# Altium schematic sheet I2C_Shield.SchDoc
size A2; SheetNumber: 1; SheetTotal: 1
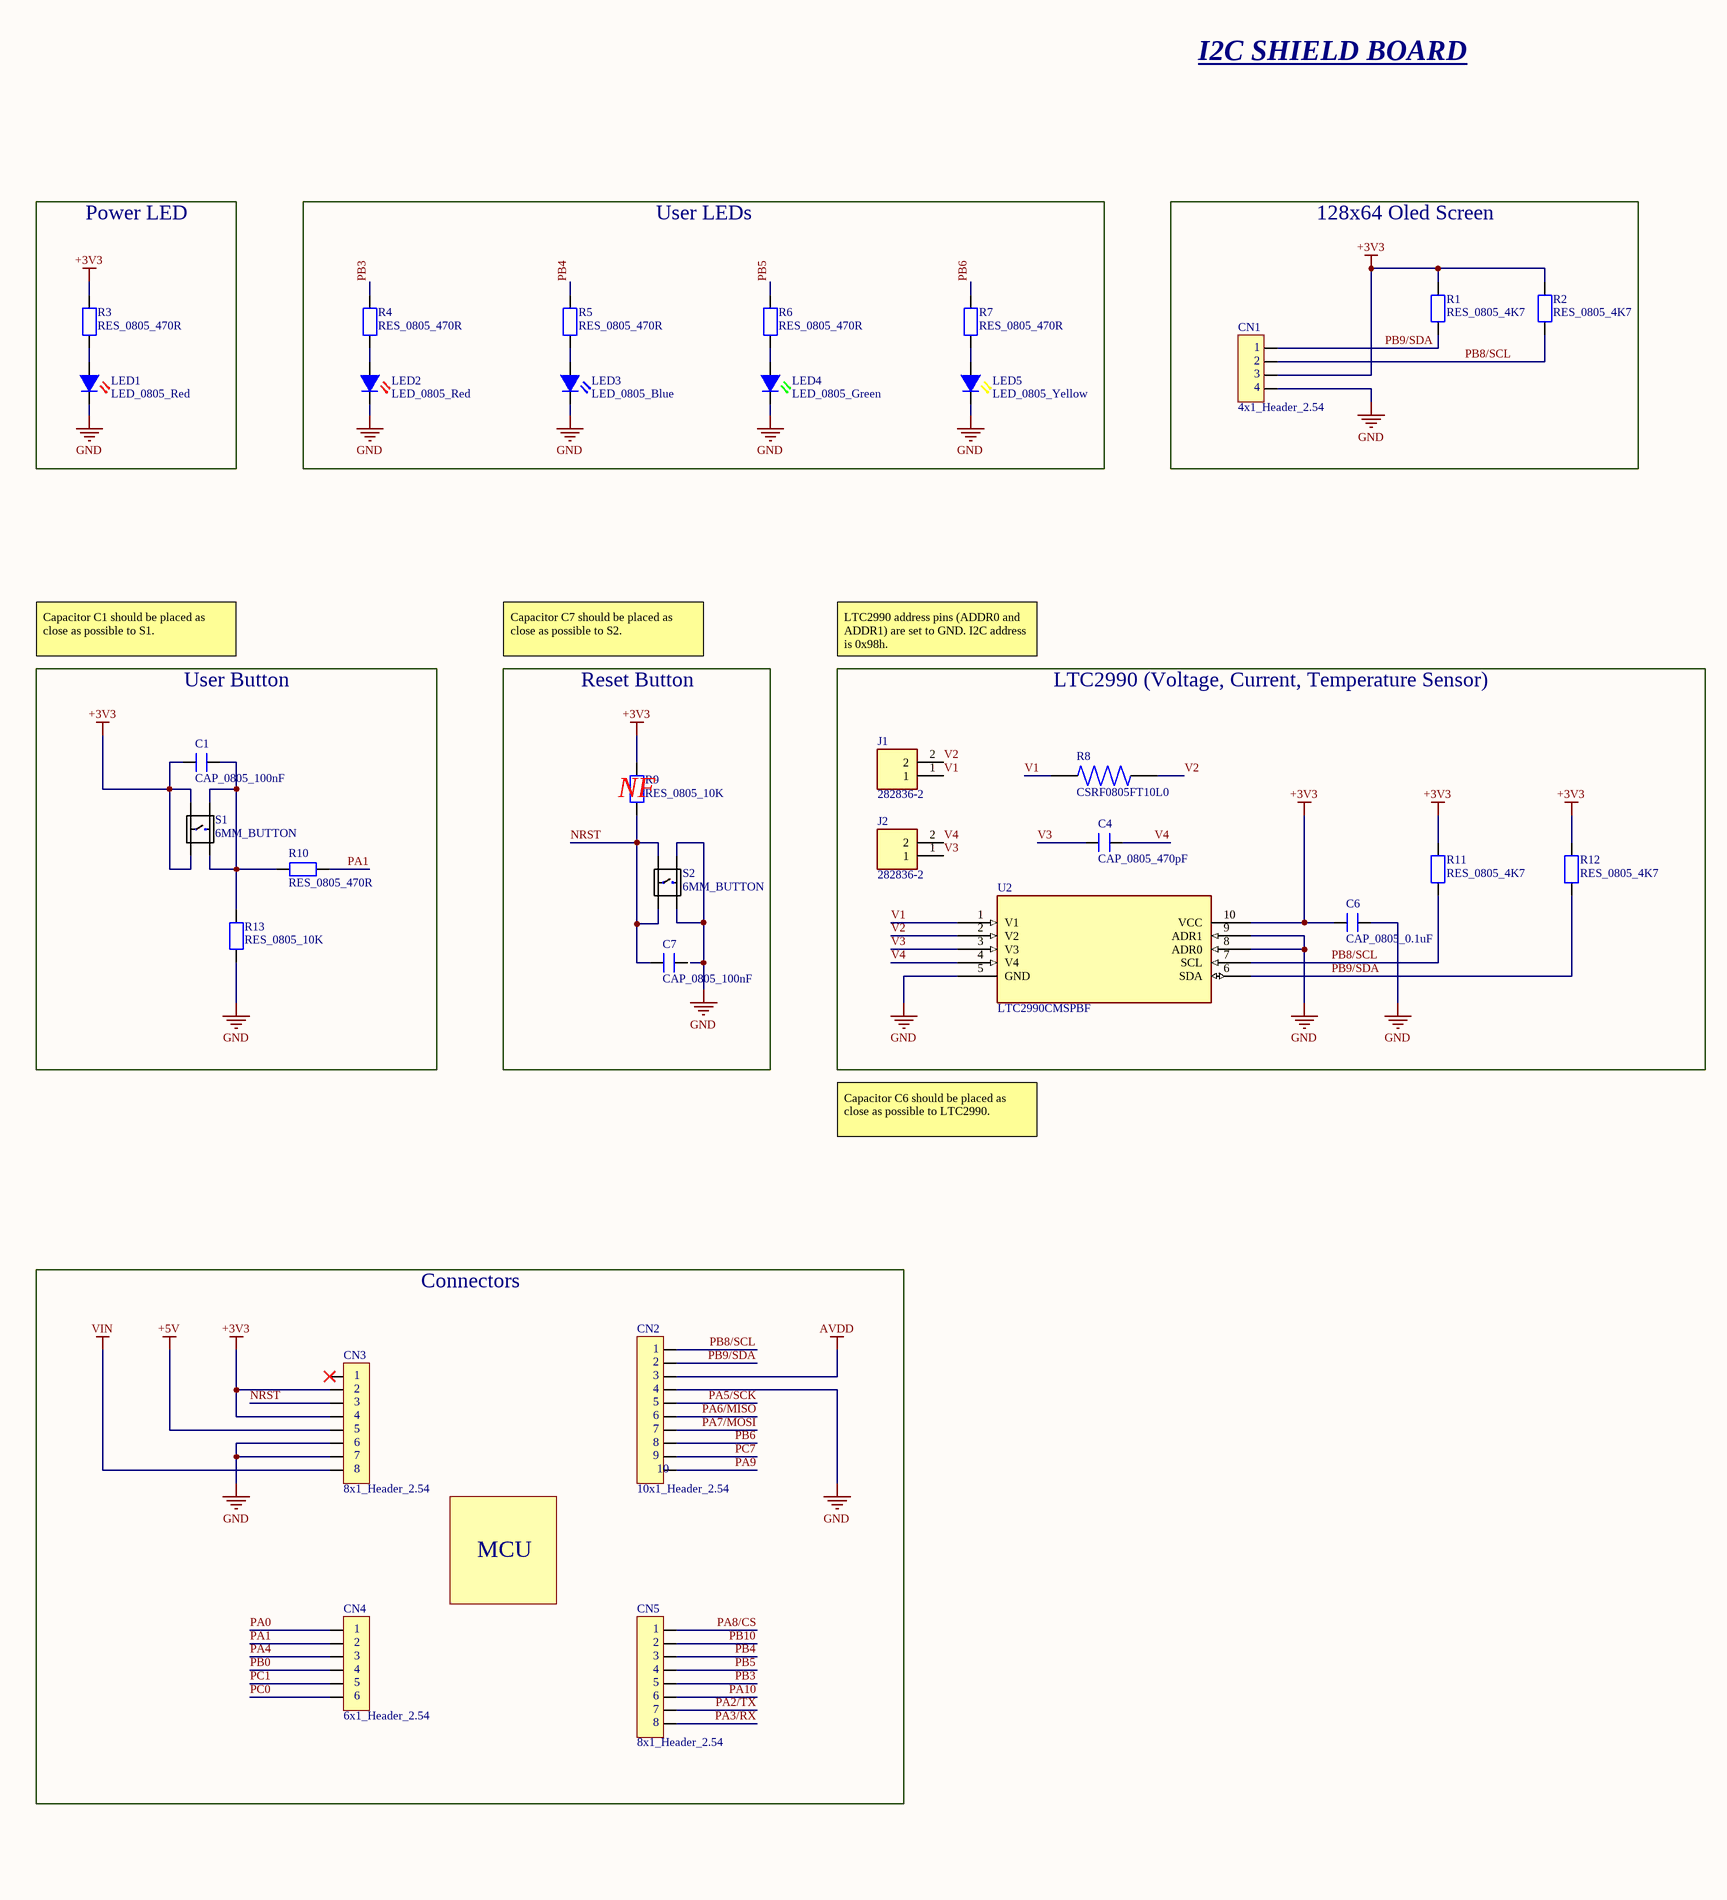
[diagram p0: I2C_Shield.SchDoc, left]
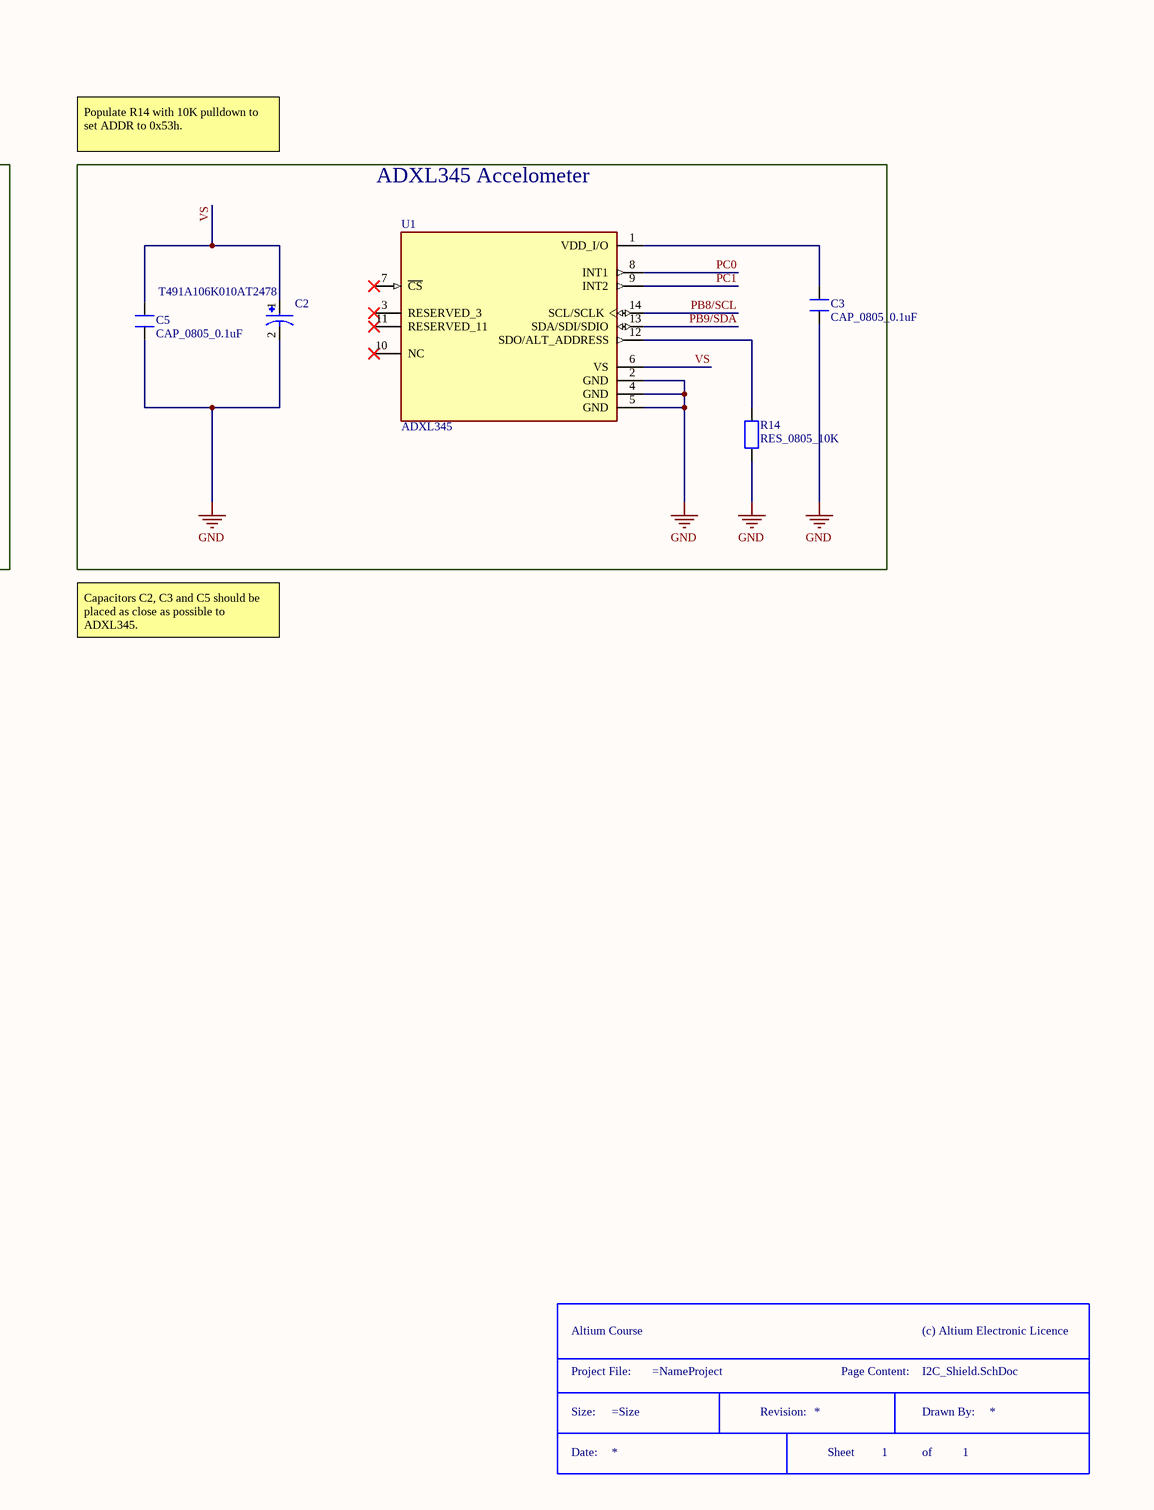
[diagram p1: I2C_Shield.SchDoc, right]

## Parts
*  Title Block  (value not drawn)  (graphical)
C1  CAP_0805_100nF  [CAP_0805]
C2  T491A106K010AT2478  [CAPMP3216X180N]
C3  CAP_0805_0.1uF  [CAP_0805]
C4  CAP_0805_470pF  [CAP_0805]
C5  CAP_0805_0.1uF  [CAP_0805]
C6  CAP_0805_0.1uF  [CAP_0805]
C7  CAP_0805_100nF  [CAP_0805]
CN1  4x1_Header_2.54
CN2  10x1_Header_2.54  [10x1_2.54MM_HEADER]
CN3  8x1_Header_2.54  [8x1_2.54MM_HEADER]
CN4  6x1_Header_2.54  [6x1_2.54MM_HEADER]
CN5  8x1_Header_2.54  [8x1_2.54MM_HEADER]
J1  282836-2  [TE_282836-2]
J2  282836-2  [TE_282836-2]
LED1  LED_0805_Red  [LED_0805]
LED2  LED_0805_Red  [LED_0805]
LED3  LED_0805_Blue  [LED_0805]
LED4  LED_0805_Green  [LED_0805]
LED5  LED_0805_Yellow  [LED_0805]
R1  RES_0805_4K7  [RES_0805]
R2  RES_0805_4K7  [RES_0805]
R3  RES_0805_470R  [RES_0805]
R4  RES_0805_470R  [RES_0805]
R5  RES_0805_470R  [RES_0805]
R6  RES_0805_470R  [RES_0805]
R7  RES_0805_470R  [RES_0805]
R8  CSRF0805FT10L0  [RESC2113X85N]
R9  RES_0805_10K  [RES_0805]
R10  RES_0805_470R  [RES_0805]
R11  RES_0805_4K7  [RES_0805]
R12  RES_0805_4K7  [RES_0805]
R13  RES_0805_10K  [RES_0805]
R14  RES_0805_10K  [RES_0805]
S1  6MM_BUTTON  [6MM_TACTILE_SWITCH]
S2  6MM_BUTTON  [6MM_TACTILE_SWITCH]
U1  ADXL345  [PQFN80P500X300X100-14N]
U2  LTC2990CMSPBF  [MSOP-10_MS]

## Blocks framed on the sheet
Power LED: LED1 R3
User LEDs: LED2-LED5 R4-R7
128x64 Oled Screen: CN1 R1 R2
User Button: C1 R10 R13 S1
NF: C7 R9 S2
LTC2990 (Voltage, Current, Temperature Sensor): C4 C6 J1 J2 R8 R11 R12 U2
ADXL345 Accelometer: C2 C3 C5 R14 U1
MCU: CN2-CN5

## Nets
+3V3: C1.1 C6.1 CN1.2 CN3.2 CN3.4 R1.2 R2.2 R3.2 R9.2 R11.1 R12.2 S1.1 S1.3 U2.10(VCC)
+5V: CN3.5
AVDD: CN2.3
GND: C2.2 C3.2 C5.1 C6.2 CN1.3 CN2.4 CN3.6 CN3.7 LED1.C LED2.C LED3.C LED4.C LED5.C R13.1 R14.1 S2.2 S2.4 U1.2(GND) U1.4(GND) U1.5(GND) U2.5(GND) U2.8(ADR0) U2.9(ADR1)
VIN: CN3.8
NRST: C7.1 CN3.3 R9.1 S2.1 S2.3
PA0: CN4.1
PA1: CN4.2 R10.2
PA2/TX: CN5.7
PA3/RX: CN5.8
PA4: CN4.3
PA5/SCK: CN2.5
PA6/MISO: CN2.6
PA7/MOSI: CN2.7
PA8/CS: CN5.1
PA9: CN2.10
PA10: CN5.6
PB0: CN4.4
PB3: CN5.5 R4.2
PB4: CN5.3 R5.2
PB5: CN5.4 R6.1
PB6: CN2.8 R7.2
PB8/SCL: CN1.1 CN2.1 R2.1 R11.2 U1.14(SCL/SCLK) U2.7(SCL)
PB9/SDA: CN1.0 CN2.2 R1.1 R12.1 U1.13(SDA/SDI/SDIO) U2.6(SDA)
PB10: CN5.2
PC0: CN4.6 U1.8(INT1)
PC1: CN4.5 U1.9(INT2)
PC7: CN2.9
V1: J1.1 R8.1 U2.1(V1)
V2: J1.2 R8.2 U2.2(V2)
V3: C4.1 J2.1 U2.3(V3)
V4: C4.2 J2.2 U2.4(V4)
VS: C2.1 C5.2 U1.6(VS)
NetC1_2: C1.2 R10.1 R13.2 S1.2 S1.4
NetC3_1: C3.1 U1.1(VDD_I/O)
NetLED1_A: LED1.A R3.1
NetLED2_A: LED2.A R4.1
NetLED3_A: LED3.A R5.1
NetLED4_A: LED4.A R6.2
NetLED5_A: LED5.A R7.1
NetR14_2: R14.2 U1.12(SDO/ALT_ADDRESS)

Not connected (* = marked no-connect by the designer): C7 2; CN3 1*; U1 3(RESERVED_3)* 7(~{CS})* 10(NC)* 11(RESERVED_11)*

## Notes on the sheet
- I2C SHIELD BOARD
- Capacitor C1 should be placed as close as possible to S1.
- Capacitor C7 should be placed as close as possible to S2.
- Reset Button
- LTC2990 address pins (ADDR0 and ADDR1) are set to GND. I2C address is 0x98h.
- Populate R14 with 10K pulldown to set ADDR to 0x53h.
- Capacitor C6 should be placed as close as possible to LTC2990.
- Capacitors C2, C3 and C5 should be placed as close as possible to ADXL345.
- Connectors
- (in symbol 4x1_Header_2.54) 4
- (in symbol Title Block) Altium Course; (c) Altium Electronic Licence; Project File:; Page Content:; Size:; Revision:; Drawn By:; Date:; Sheet; of

## Library data of the parts
C1 C7 = CAP_0805_100nF: 0805 100nF 16VDC ±10% X7R; Manufacturer: CC0805KRX7R7BB104; Voltage Rating: 16V; Tolerance: 10%; Package Size: 0805; Dielectric: X7R
C2 = T491A106K010AT2478: 10 ÂµF Molded Tantalum Capacitors 10 V 1206 (3216 Metric) 3.8Ohm; MF: KEMET; Price: None; Value: *; MP: T491A106K010AT2478; Package: SMD-2 KEMET; Purchase-URL: https://pricing.snapeda.com/search/part/T491A106K010AT2478/?ref=eda; SnapEDA_Link: https://www.snapeda.com/parts/T491A106K010AT2478/KEMET/view-part/?ref=snap; Check_prices: https://www.snapeda.com/parts/T491A106K010AT2478/KEMET/view-part/?ref=eda; Availability: In Stock
C3 C5 C6 = CAP_0805_0.1uF: 0805 0.1uF 16VDC ±10% X7R; Manufacturer: CC0805KRX7R7BB104; Voltage Rating: 16V; Tolerance: 10%; Package Size: 0805; Dielectric: X7R
C4 = CAP_0805_470pF: 0805 470pF 16VDC ±10% X7R; Manufacturer: CC0805KRX7R7BB104; Voltage Rating: 16V; Tolerance: 10%; Package Size: 0805; Dielectric: X7R
CN1 = 4x1_Header_2.54: Oled Screen Header
J1 J2 = 282836-2: Connector, Terminal Block; Wire Receptacle; 2 Pos.; 16-30 AWG; 0.197 in. CL; Sid; MF: TE Connectivity; Purchase-URL: https://pricing.snapeda.com/search/part/282836-2/?ref=eda; Value: *; MP: 282836-2; Package: None; Check_prices: https://www.snapeda.com/parts/282836-2/TE+Connectivity+AMP+Connectors/view-part/?ref=eda; Price: None; SnapEDA_Link: https://www.snapeda.com/parts/282836-2/TE+Connectivity+AMP+Connectors/view-part/?ref=snap; Availability: In Stock
LED1 LED2 = LED_0805_Red: LED SMD 0805 RED 550mcd; Manufacturer: HL-PSC-2012S9AC; Voltage Rating: 2.6V; Current: 20mA; Package Size: 0805
LED3 = LED_0805_Blue: LED SMD 0805 BLUE 550mcd; Manufacturer: HL-PSC-2012H203BC; Voltage Rating: 2.6V; Current: 20mA; Package Size: 0805
LED4 = LED_0805_Green: LED SMD 0805 GREEN 550mcd; Manufacturer: HL-PSC-2012U51GC; Voltage Rating: 2.6V; Current: 20mA; Package Size: 0805
LED5 = LED_0805_Yellow: LED SMD 0805 YELLOW 550mcd; Manufacturer: HL-PSC-2012S29YC; Voltage Rating: 2.6V; Current: 20mA; Package Size: 0805
R1 R2 R11 R12 = RES_0805_4K7: 0805 4K7 Ohms 5% 1/8W; Manufacturer: RC0805JR-0710KL; Voltage Rating: 150V; Tolerance: 5%; Package Size: 0805
R3-R7 R10 = RES_0805_470R: 0805 470 Ohms 5% 1/8W; Manufacturer: RC0805JR-07470RL; Voltage Rating: 150V; Tolerance: 5%; Package: 0805
R8 = CSRF0805FT10L0: 10 mOhms Â±1% 0.5W, 1/2W Chip Resistor 0805 (2012 Metric) Automotive AEC-Q200, Current Sense, Moisture Resistant Metal Foil; MF: Stackpole Electronics; SnapEDA_Link: https://www.snapeda.com/parts/CSRF0805FT10L0/Stackpole+Electronics/view-part/?ref=snap; Package: 0805 Stackpole Electronics; Value: *; MP: CSRF0805FT10L0; Check_prices: https://www.snapeda.com/parts/CSRF0805FT10L0/Stackpole+Electronics/view-part/?ref=eda
R9 R13 R14 = RES_0805_10K: 0805 10K Ohms 5% 1/8W; Manufacturer: RC0805JR-0710KL; Voltage Rating: 150V; Tolerance: 5%; Package Size: 0805
S1 S2 = 6MM_BUTTON: SWITCH TACT 6x6MM; Manufacturer: DS1042-03-116-KKR-250-10; Voltage Rating: 12V; Current: 50mA; Package Size: 6mmx6mm
U1 = ADXL345: Accelerometer X, Y, Z Axis ±2g, 4g, 8g, 16g 0.05Hz ~ 1.6kHz 14-LGA (3x5); MF: Analog Devices, Inc.; SnapEDA_Link: https://www.snapeda.com/parts/ADXL345/Analog+Devices/view-part/?ref=snap; Package: LGA -14 Analog Devices; Value: *; MP: ADXL345; Check_prices: https://www.snapeda.com/parts/ADXL345/Analog+Devices/view-part/?ref=eda
U2 = LTC2990CMSPBF: IC, SUPERVISORY, 1.1mA, 5.5V, MSOP10; No; IC, SUPERVISORY, 1.1mA, 5.5V, MSOP10; No. of Supervisors / Monitors:4; Supply Voltage Range:2.9V to 5.5V; Digital IC Case Style:MSOP; No. of Pins:10; Supply Current:1.1mA; Delay Time:46ms; Operating Temperature Ra; MF: Analog Devices; MP: LTC2990CMS#PBF; SnapEDA_Link: https://www.snapeda.com/parts/LTC2990CMS%23PBF/Analog+Devices/view-part/?ref=snap; Package: MSOP-10 Linear Technology; Value: *; Check_prices: https://www.snapeda.com/parts/LTC2990CMS%23PBF/Analog+Devices/view-part/?ref=eda